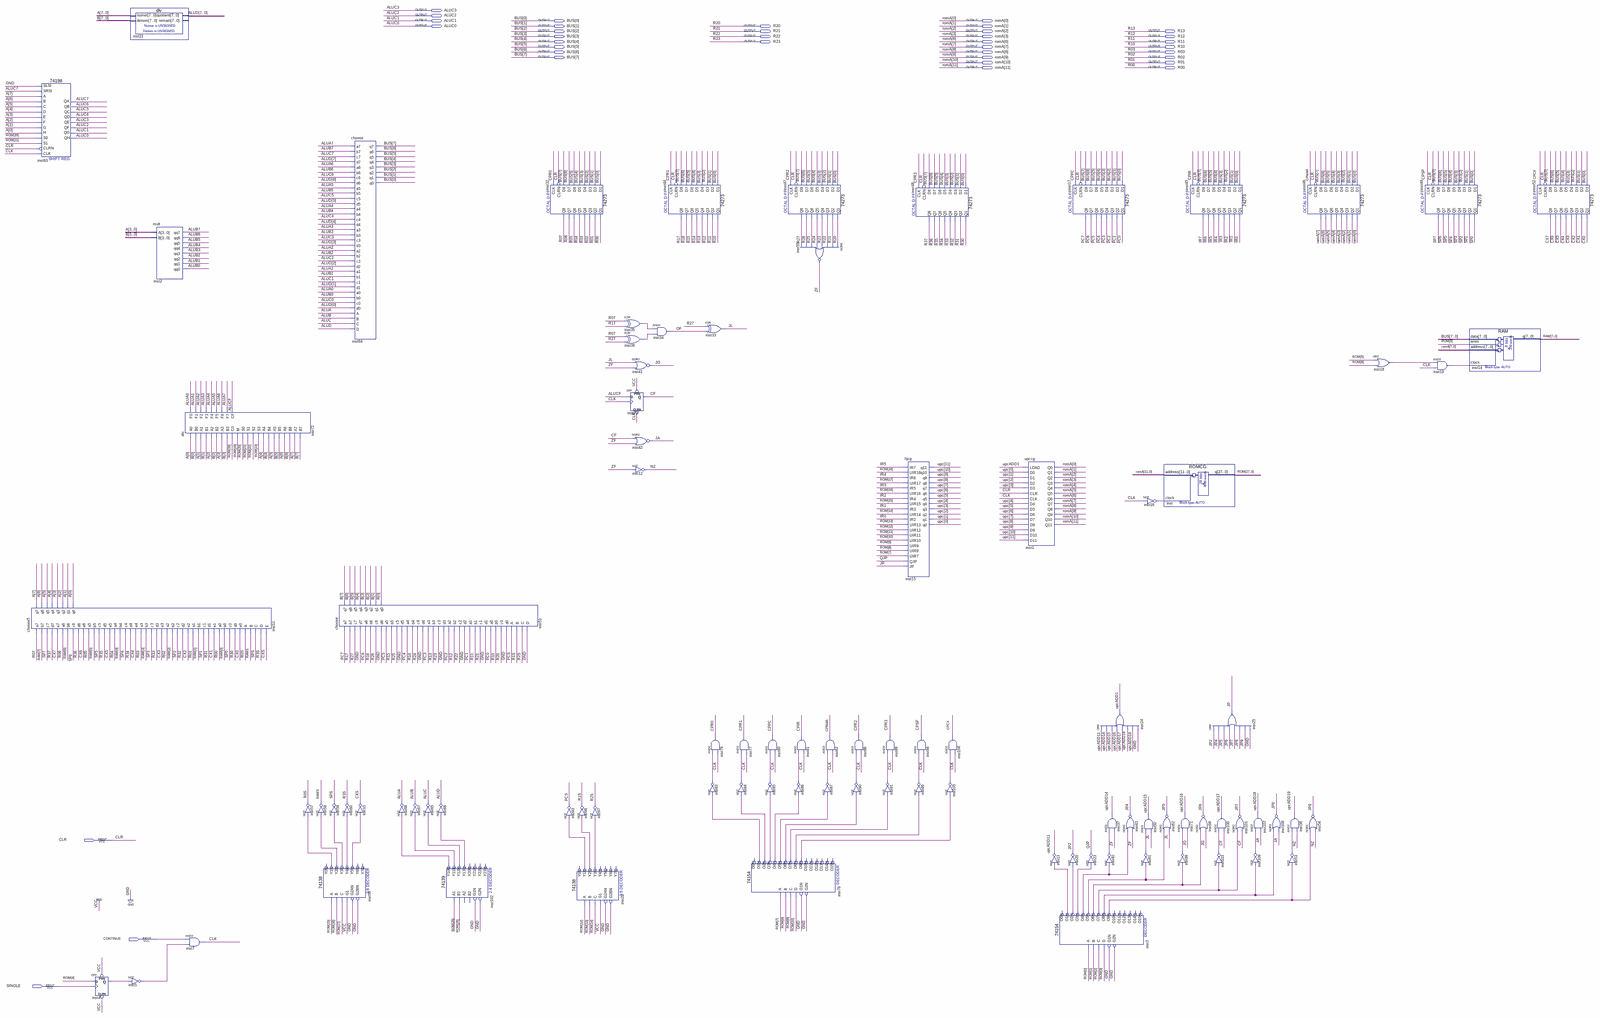
[diagram p0: schematic sheet, whole]
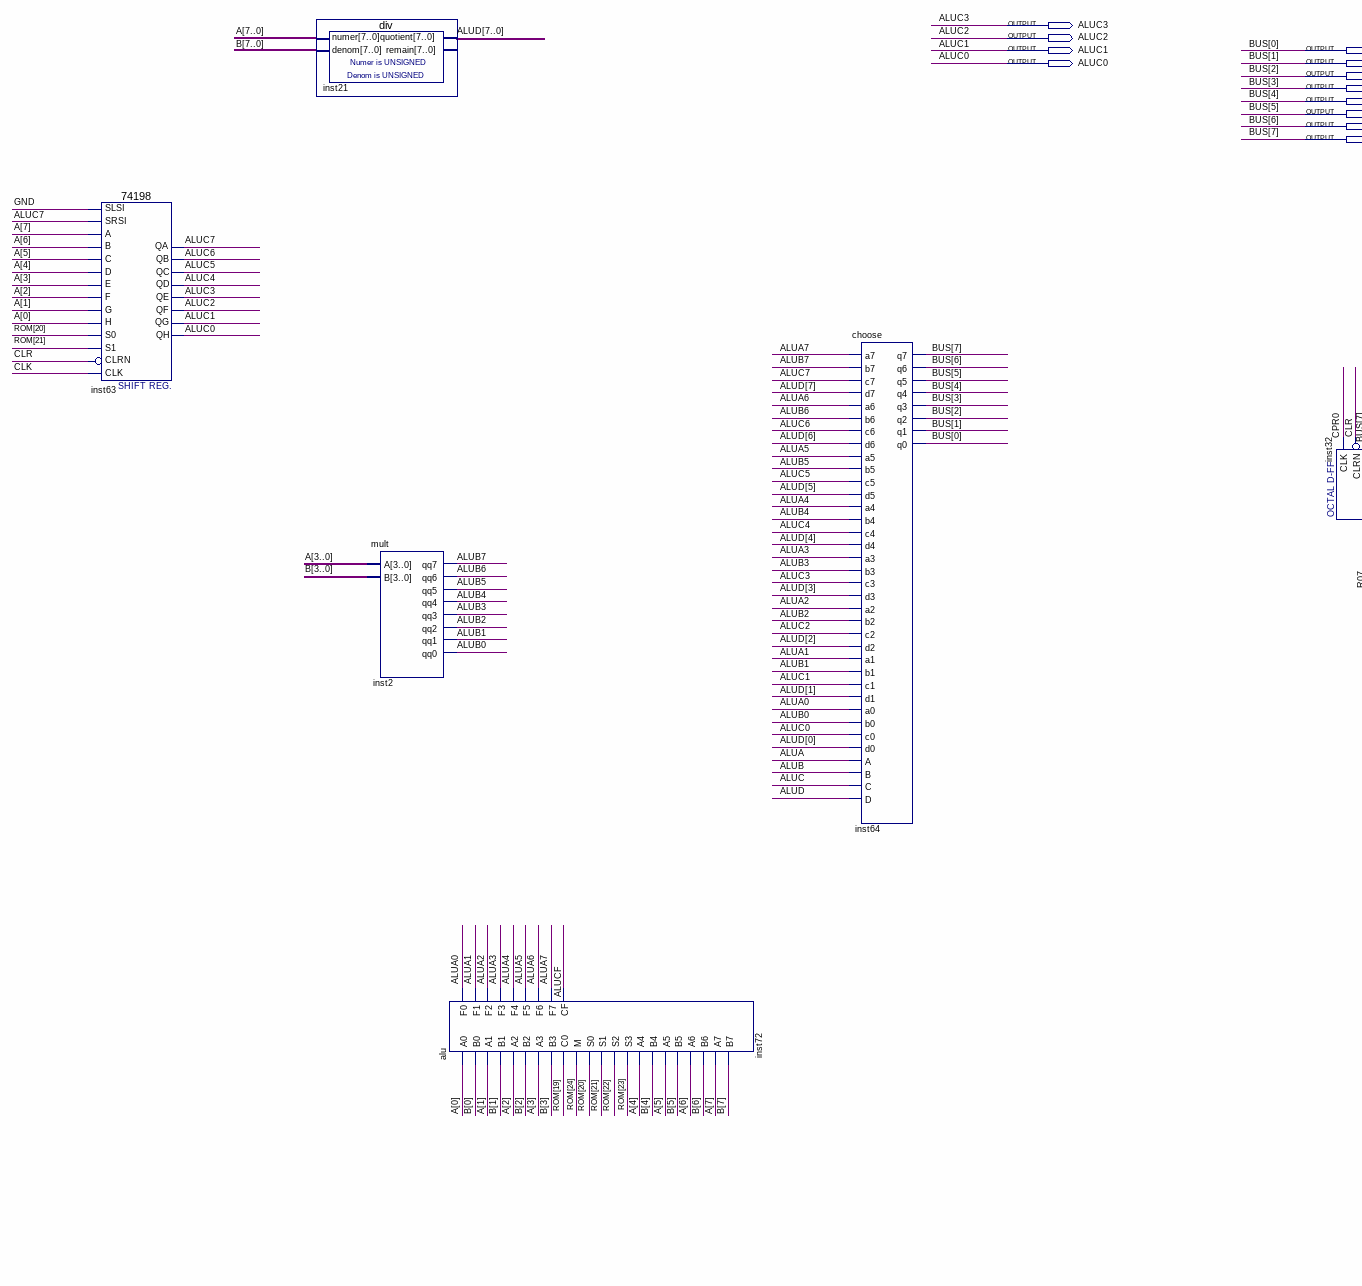
[diagram p1: schematic sheet, upper left part]
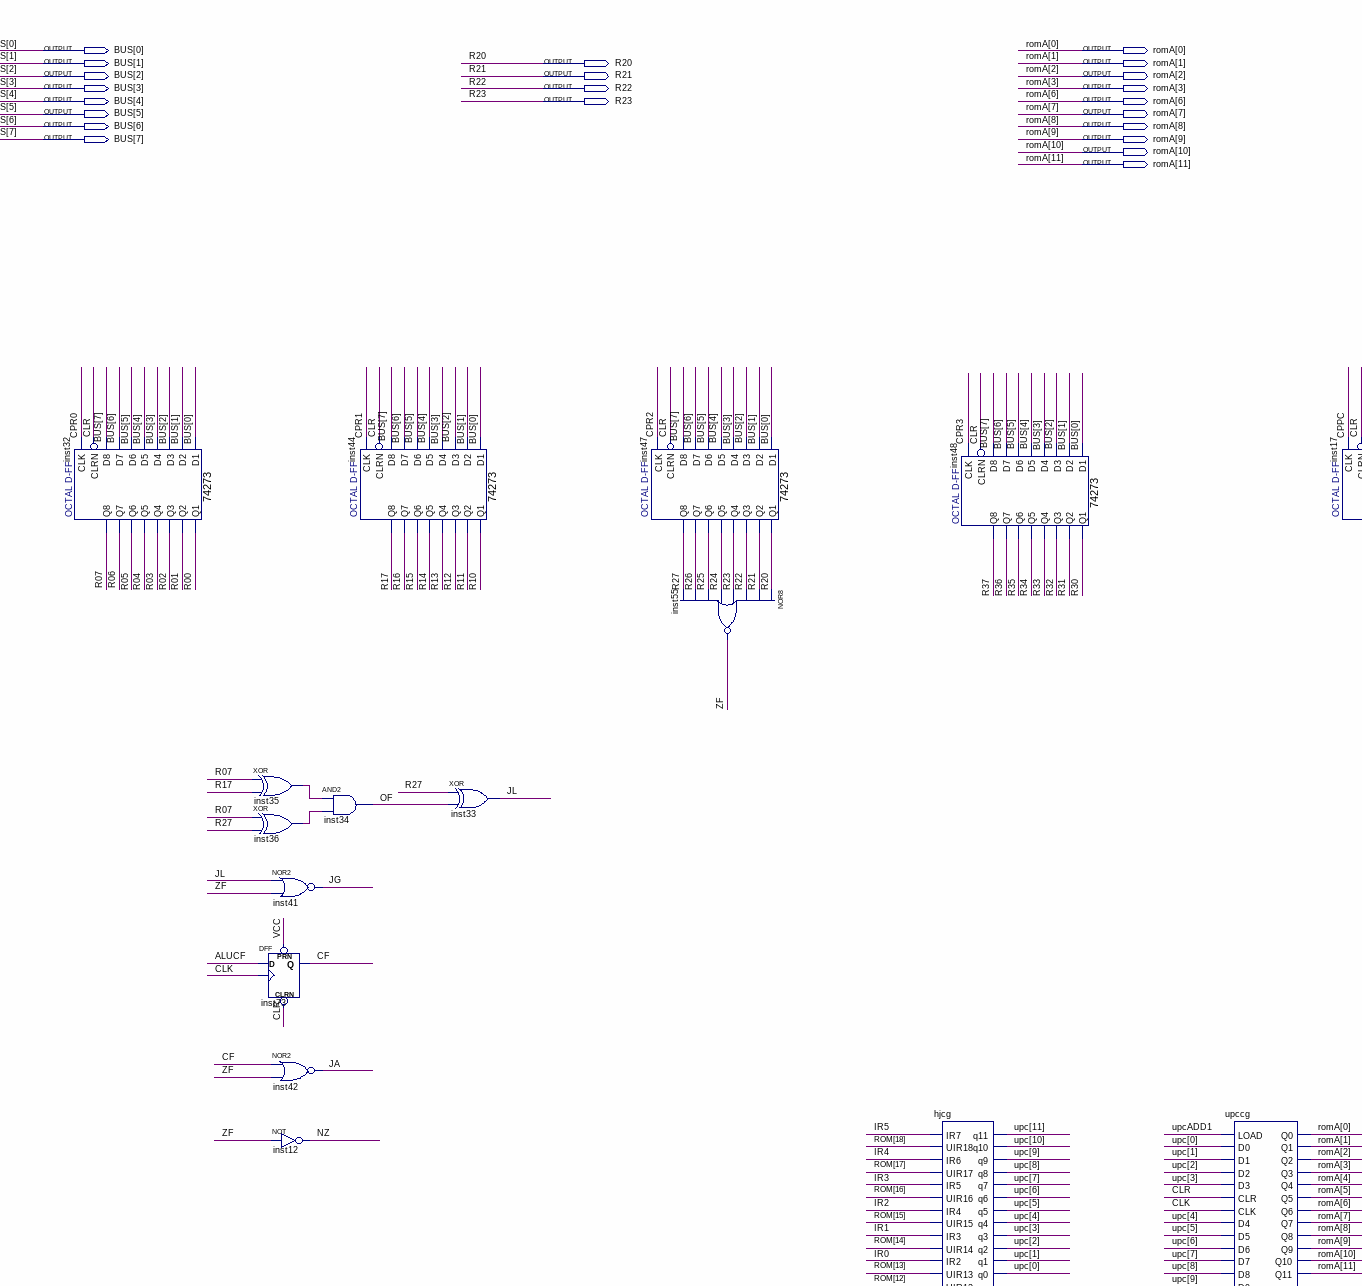
[diagram p2: schematic sheet, upper centre part]
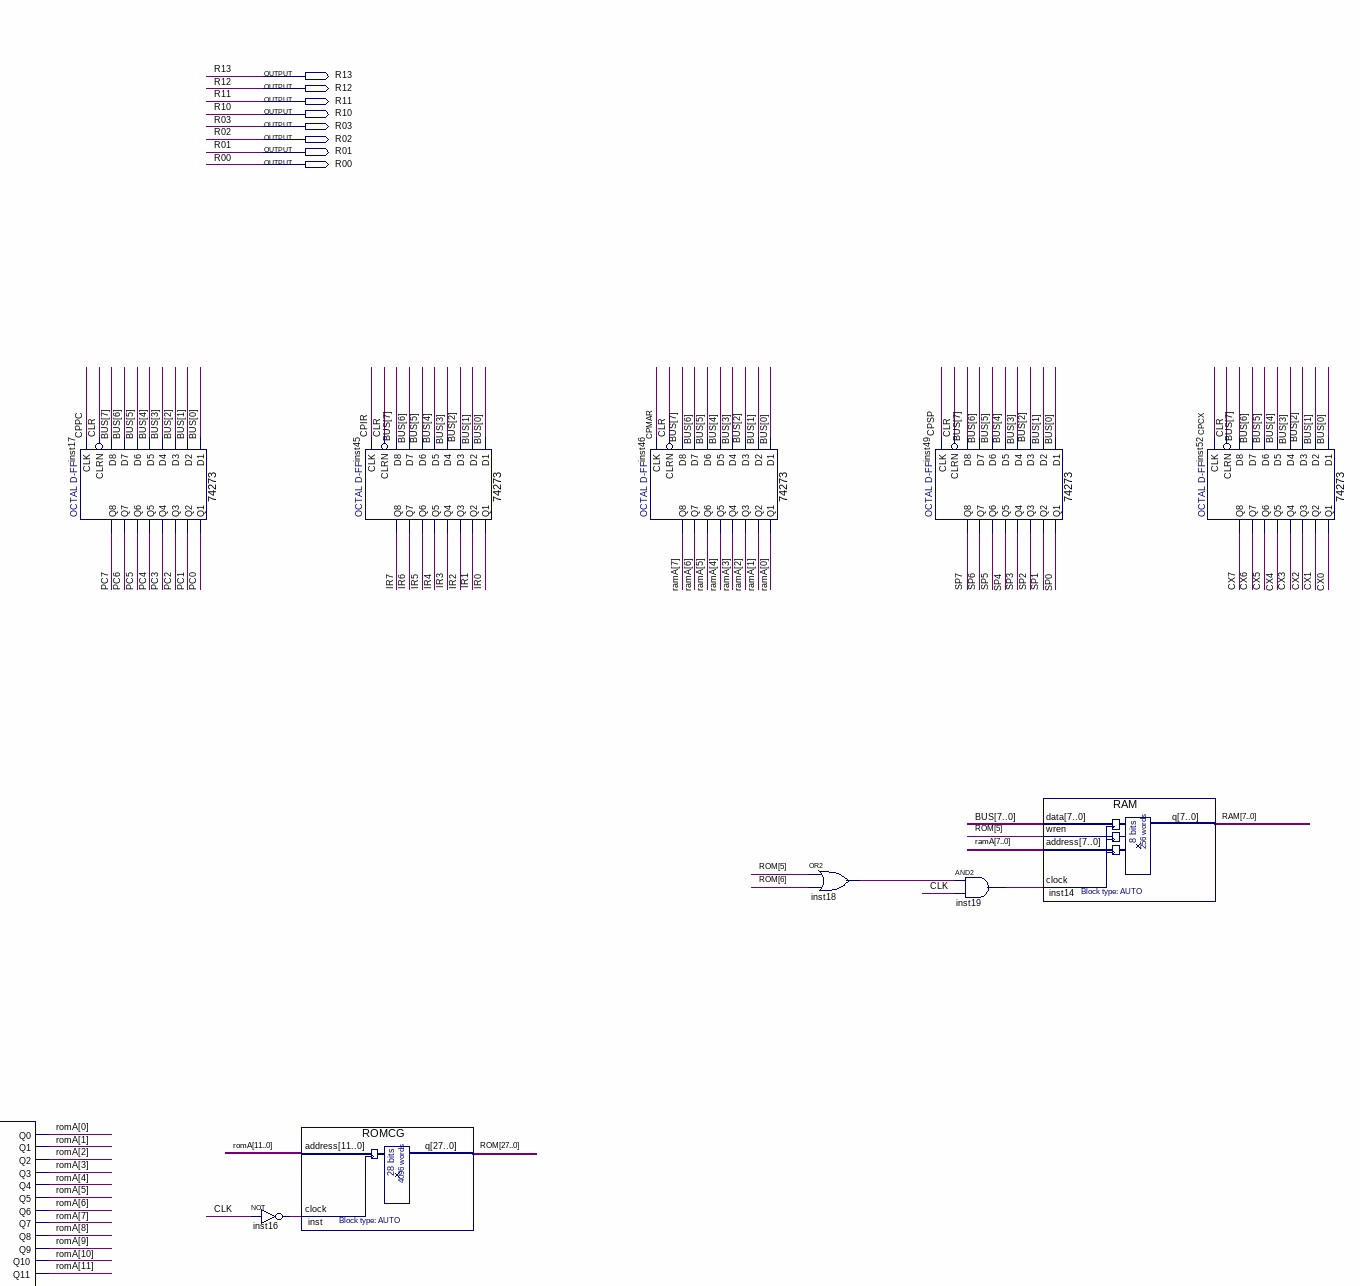
[diagram p3: schematic sheet, upper right part]
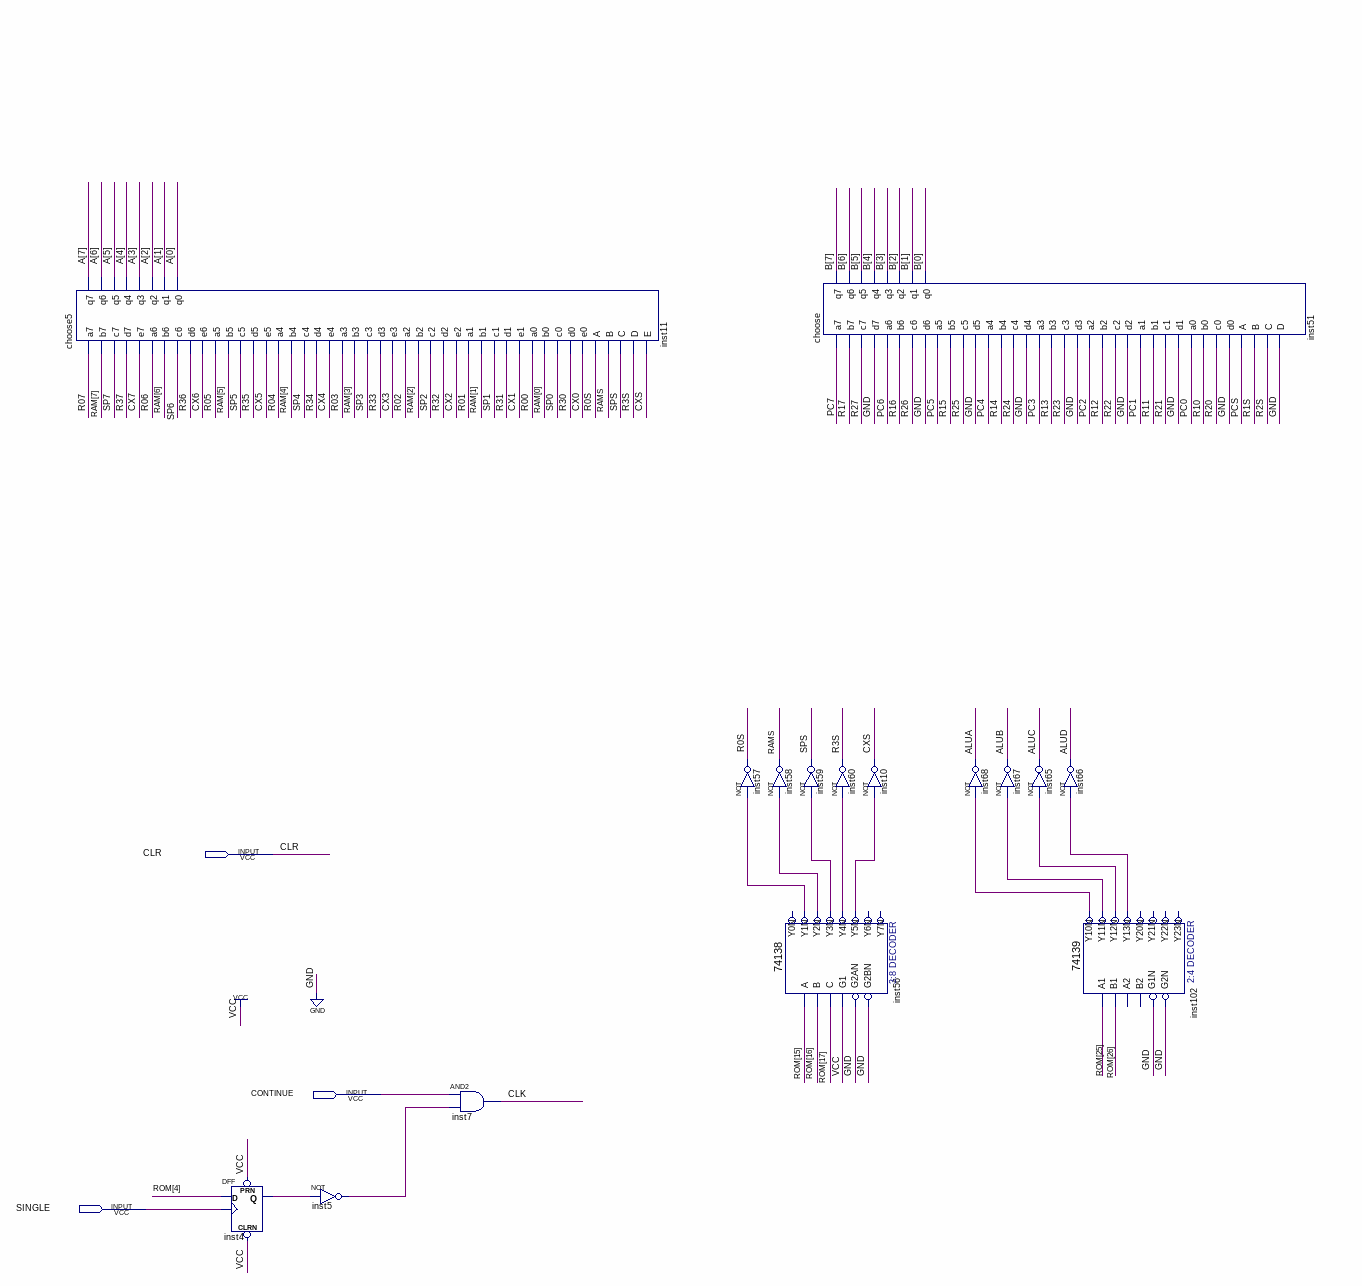
[diagram p4: schematic sheet, lower left part]
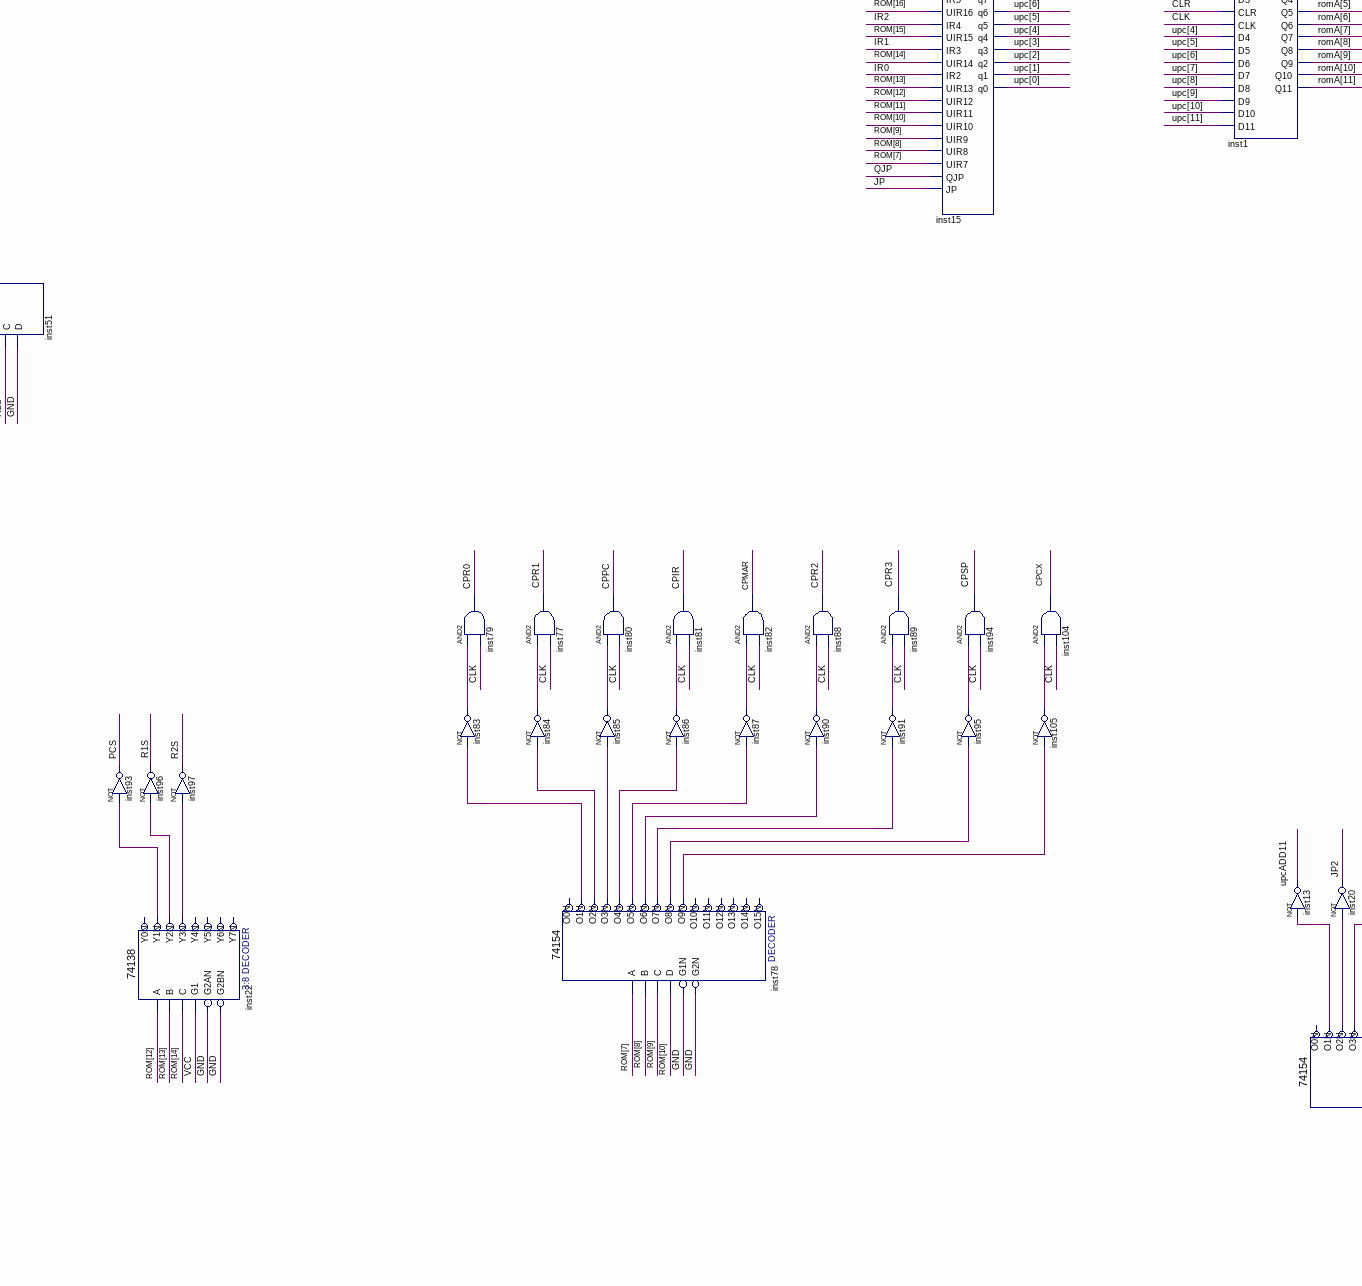
[diagram p5: schematic sheet, lower centre part]
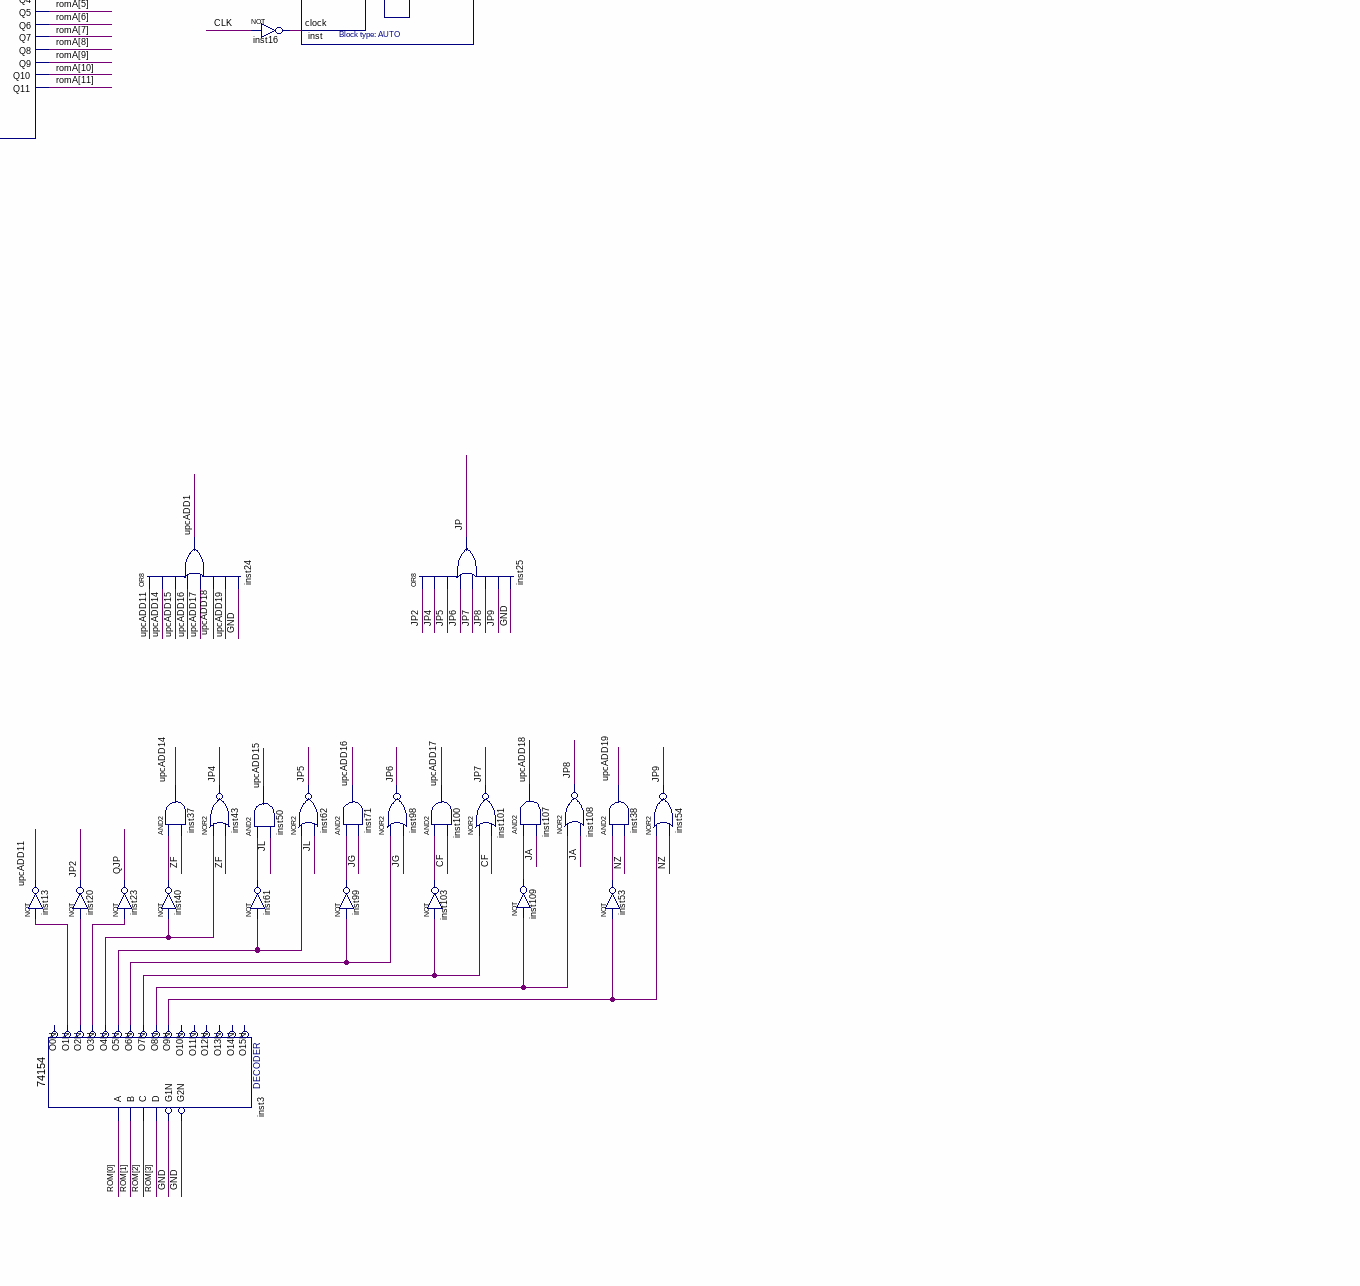
[diagram p6: schematic sheet, lower right part]
// Quartus schematic 3.bdf as structural Verilog: 93 symbols, 37 pins
module \3  (
  input  CLR,
  input  CONTINUE,
  input  SINGLE,
  output ALUC3,
  output ALUC2,
  output ALUC1,
  output [7:0] BUS,
  output [11:0] romA,
  output ALUC0,
  output R20,
  output R21,
  output R13,
  output R22,
  output R12,
  output R23,
  output R11,
  output R10,
  output R03,
  output R02,
  output R01,
  output R00
);

  wire ALUA, ALUA0, ALUA1, ALUA2, ALUA3, ALUA4, ALUA5, ALUA6, ALUA7, ALUB, ALUB0, ALUB1, ALUB2, ALUB3, ALUB4,
       ALUB5, ALUB6, ALUB7, ALUC, ALUC4, ALUC5, ALUC6, ALUC7, ALUCF, ALUD_1bit, CF, CLK, CPCX, CPIR, CPMAR,
       CPPC, CPR0, CPR1, CPR2, CPR3, CPSP, CX0, CX1, CX2, CX3, CX4, CX5, CX6, CX7, CXS, inst3_o1n, inst3_o2n,
       inst3_o3n, inst3_o4n, inst3_o5n, inst3_o6n, inst3_o7n, inst3_o8n, inst3_o9n, inst4_q, inst5_out,
       inst16_out, inst18_out, inst19_out, inst22_y1n, inst22_y2n, inst22_y3n, inst35_out, inst36_out,
       inst40_out, inst53_out, inst56_y1n, inst56_y2n, inst56_y3n, inst56_y4n, inst56_y5n, inst61_out,
       inst78_o1n, inst78_o2n, inst78_o3n, inst78_o4n, inst78_o5n, inst78_o6n, inst78_o7n, inst78_o8n,
       inst78_o9n, inst83_out, inst84_out, inst85_out, inst86_out, inst87_out, inst90_out, inst91_out,
       inst95_out, inst99_out, inst102_y10n, inst102_y11n, inst102_y12n, inst102_y13n, inst103_out,
       inst105_out, inst109_out, IR0, IR1, IR2, IR3, IR4, IR5, IR6, IR7, JA, JG, JL, JP, JP2, JP4, JP5, JP6,
       JP7, JP8, JP9, NZ, OF, PC0, PC1, PC2, PC3, PC4, PC5, PC6, PC7, PCS, QJP, R0S, R1S, R2S, R3S, R04, R05,
       R06, R07, R14, R15, R16, R17, R24, R25, R26, R27, R30, R31, R32, R33, R34, R35, R36, R37, RAMS, SP0,
       SP1, SP2, SP3, SP4, SP5, SP6, SP7, SPS, upcADD1, upcADD11, upcADD14, upcADD15, upcADD16, upcADD17,
       upcADD18, upcADD19, ZF;
  wire [7:0] A, ALUD, B, RAM, ramA;
  wire [11:0] upc;
  wire [27:0] ROM;

  choose5 inst11 (
    .a7(R07), .b7(RAM[7]), .c7(SP7), .d7(R37), .e7(CX7), .a6(R06), .b6(RAM[6]), .c6(SP6), .d6(R36), .e6(CX6),
    .a5(R05), .b5(RAM[5]), .c5(SP5), .d5(R35), .e5(CX5), .a4(R04), .b4(RAM[4]), .c4(SP4), .d4(R34), .e4(CX4),
    .a3(R03), .b3(RAM[3]), .c3(SP3), .d3(R33), .e3(CX3), .a2(R02), .b2(RAM[2]), .c2(SP2), .d2(R32), .e2(CX2),
    .a1(R01), .b1(RAM[1]), .c1(SP1), .d1(R31), .e1(CX1), .a0(R00), .b0(RAM[0]), .c0(SP0), .d0(R30), .e0(CX0),
    .A(R0S), .B(RAMS), .C(SPS), .D(R3S), .E(CXS), .q7(A[7]), .q6(A[6]), .q5(A[5]), .q4(A[4]), .q3(A[3]),
    .q2(A[2]), .q1(A[1]), .q0(A[0]));
  \74198  inst63 (
    .A(A[7]), .SRSI(ALUC7), .SLSI(1'b0), .E(A[3]), .S0(ROM[20]), .B(A[6]), .C(A[5]), .D(A[4]), .H(A[0]),
    .G(A[1]), .CLRN(CLR), .CLK(CLK), .F(A[2]), .S1(ROM[21]), .QD(ALUC4), .QC(ALUC5), .QH(ALUC0), .QA(ALUC7),
    .QB(ALUC6), .QE(ALUC3), .QF(ALUC2), .QG(ALUC1));
  DFF inst4 (.CLRN(1'b1), .CLK(SINGLE), .D(ROM[4]), .PRN(1'b1), .Q(inst4_q));
  div inst21 (.numer(A), .denom(B), .quotient(ALUD));  // open: remain
  not inst5 (inst5_out, inst4_q);
  mult inst2 (
    .A(A[3:0]), .B(B[3:0]), .qq7(ALUB7), .qq6(ALUB6), .qq5(ALUB5), .qq4(ALUB4), .qq3(ALUB3), .qq2(ALUB2),
    .qq1(ALUB1), .qq0(ALUB0));
  alu inst72 (
    .A0(A[0]), .B0(B[0]), .A1(A[1]), .B1(B[1]), .A2(A[2]), .B2(B[2]), .A3(A[3]), .B3(B[3]), .C0(ROM[19]),
    .M(ROM[24]), .S0(ROM[20]), .S1(ROM[21]), .S2(ROM[22]), .S3(ROM[23]), .A4(A[4]), .B4(B[4]), .A5(A[5]),
    .B5(B[5]), .A6(A[6]), .B6(B[6]), .A7(A[7]), .B7(B[7]), .F0(ALUA0), .F1(ALUA1), .F2(ALUA2), .F3(ALUA3),
    .F4(ALUA4), .F5(ALUA5), .F6(ALUA6), .F7(ALUA7), .CF(ALUCF));
  and inst7 (CLK, CONTINUE, inst5_out);
  not inst57 (R0S, inst56_y1n);
  not inst58 (RAMS, inst56_y2n);
  \74138  inst56 (
    .A(ROM[15]), .B(ROM[16]), .G1(1'b1), .C(ROM[17]), .G2AN(1'b0), .G2BN(1'b0), .Y1N(inst56_y1n),
    .Y2N(inst56_y2n), .Y3N(inst56_y3n), .Y4N(inst56_y4n), .Y5N(inst56_y5n));  // open: Y0N, Y6N, Y7N
  choose inst51 (
    .a7(PC7), .b7(R17), .c7(R27), .d7(1'b0), .a6(PC6), .b6(R16), .c6(R26), .d6(1'b0), .a5(PC5), .b5(R15),
    .c5(R25), .d5(1'b0), .a4(PC4), .b4(R14), .c4(R24), .d4(1'b0), .a3(PC3), .b3(R13), .c3(R23), .d3(1'b0),
    .a2(PC2), .b2(R12), .c2(R22), .d2(1'b0), .a1(PC1), .b1(R11), .c1(R21), .d1(1'b0), .a0(PC0), .b0(R10),
    .c0(R20), .d0(1'b0), .A(PCS), .B(R1S), .C(R2S), .D(1'b0), .q7(B[7]), .q6(B[6]), .q5(B[5]), .q4(B[4]),
    .q3(B[3]), .q2(B[2]), .q1(B[1]), .q0(B[0]));
  not inst59 (SPS, inst56_y3n);
  not inst60 (R3S, inst56_y4n);
  choose inst64 (
    .a7(ALUA7), .b7(ALUB7), .c7(ALUC7), .d7(ALUD[7]), .a6(ALUA6), .b6(ALUB6), .c6(ALUC6), .d6(ALUD[6]),
    .a5(ALUA5), .b5(ALUB5), .c5(ALUC5), .d5(ALUD[5]), .a4(ALUA4), .b4(ALUB4), .c4(ALUC4), .d4(ALUD[4]),
    .a3(ALUA3), .b3(ALUB3), .c3(ALUC3), .d3(ALUD[3]), .a2(ALUA2), .b2(ALUB2), .c2(ALUC2), .d2(ALUD[2]),
    .a1(ALUA1), .b1(ALUB1), .c1(ALUC1), .d1(ALUD[1]), .a0(ALUA0), .b0(ALUB0), .c0(ALUC0), .d0(ALUD[0]),
    .A(ALUA), .B(ALUB), .C(ALUC), .D(ALUD_1bit), .q7(BUS[7]), .q6(BUS[6]), .q5(BUS[5]), .q4(BUS[4]),
    .q3(BUS[3]), .q2(BUS[2]), .q1(BUS[1]), .q0(BUS[0]));
  not inst10 (CXS, inst56_y5n);
  not inst67 (ALUB, inst102_y11n);
  not inst68 (ALUA, inst102_y10n);
  not inst65 (ALUC, inst102_y12n);
  not inst66 (ALUD_1bit, inst102_y13n);
  \74139  inst102 (
    .A1(ROM[25]), .B1(ROM[26]), .G1N(1'b0), .G2N(1'b0), .Y10N(inst102_y10n), .Y13N(inst102_y13n),
    .Y12N(inst102_y12n), .Y11N(inst102_y11n));  // open: A2, B2, Y20N, Y21N, Y22N, Y23N
  \74273  inst32 (
    .D2(BUS[1]), .D3(BUS[2]), .D1(BUS[0]), .D4(BUS[3]), .D7(BUS[6]), .D6(BUS[5]), .D5(BUS[4]), .D8(BUS[7]),
    .CLK(CPR0), .CLRN(CLR), .Q4(R03), .Q1(R00), .Q2(R01), .Q3(R02), .Q6(R05), .Q5(R04), .Q7(R06), .Q8(R07));
  not inst93 (PCS, inst22_y1n);
  not inst96 (R1S, inst22_y2n);
  \74138  inst22 (
    .A(ROM[12]), .B(ROM[13]), .G1(1'b1), .C(ROM[14]), .G2AN(1'b0), .G2BN(1'b0), .Y1N(inst22_y1n),
    .Y2N(inst22_y2n), .Y3N(inst22_y3n));  // open: Y0N, Y4N, Y5N, Y6N, Y7N
  not inst97 (R2S, inst22_y3n);
  xor inst35 (inst35_out, R07, R17);
  xor inst36 (inst36_out, R07, R27);
  nor inst41 (JG, JL, ZF);
  DFF inst73 (.CLRN(CLR), .CLK(CLK), .D(ALUCF), .PRN(1'b1), .Q(CF));
  nor inst42 (JA, CF, ZF);
  not inst12 (NZ, ZF);
  and inst34 (OF, inst35_out, inst36_out);
  \74273  inst44 (
    .D2(BUS[1]), .D3(BUS[2]), .D1(BUS[0]), .D4(BUS[3]), .D7(BUS[6]), .D6(BUS[5]), .D5(BUS[4]), .D8(BUS[7]),
    .CLK(CPR1), .CLRN(CLR), .Q4(R13), .Q1(R10), .Q2(R11), .Q3(R12), .Q6(R15), .Q5(R14), .Q7(R16), .Q8(R17));
  xor inst33 (JL, R27, OF);
  and inst79 (CPR0, inst83_out, CLK);
  not inst83 (inst83_out, inst78_o1n);
  and inst77 (CPR1, inst84_out, CLK);
  not inst84 (inst84_out, inst78_o2n);
  and inst80 (CPPC, inst85_out, CLK);
  not inst85 (inst85_out, inst78_o3n);
  \74154  inst78 (
    .C(ROM[9]), .D(ROM[10]), .B(ROM[8]), .A(ROM[7]), .G1N(1'b0), .G2N(1'b0), .O1N(inst78_o1n),
    .O4N(inst78_o4n), .O3N(inst78_o3n), .O2N(inst78_o2n), .O7N(inst78_o7n), .O6N(inst78_o6n),
    .O5N(inst78_o5n), .O9N(inst78_o9n), .O8N(inst78_o8n));  // open: O0N, O12N, O15N, O10N, O11N, O13N, O14N
  \74273  inst47 (
    .D2(BUS[1]), .D3(BUS[2]), .D1(BUS[0]), .D4(BUS[3]), .D7(BUS[6]), .D6(BUS[5]), .D5(BUS[4]), .D8(BUS[7]),
    .CLK(CPR2), .CLRN(CLR), .Q4(R23), .Q1(R20), .Q2(R21), .Q3(R22), .Q6(R25), .Q5(R24), .Q7(R26), .Q8(R27));
  nor inst55 (ZF, R20, R21, R22, R23, R24, R25, R26, R27);
  and inst81 (CPIR, inst86_out, CLK);
  not inst86 (inst86_out, inst78_o4n);
  and inst82 (CPMAR, inst87_out, CLK);
  not inst87 (inst87_out, inst78_o5n);
  and inst88 (CPR2, inst90_out, CLK);
  not inst90 (inst90_out, inst78_o6n);
  and inst89 (CPR3, inst91_out, CLK);
  not inst91 (inst91_out, inst78_o7n);
  \74273  inst48 (
    .D2(BUS[1]), .D3(BUS[2]), .D1(BUS[0]), .D4(BUS[3]), .D7(BUS[6]), .D6(BUS[5]), .D5(BUS[4]), .D8(BUS[7]),
    .CLK(CPR3), .CLRN(CLR), .Q4(R33), .Q1(R30), .Q2(R31), .Q3(R32), .Q6(R35), .Q5(R34), .Q7(R36), .Q8(R37));
  hjcg inst15 (
    .IR7(IR5), .UIR18(ROM[18]), .IR6(IR4), .UIR17(ROM[17]), .IR5(IR3), .UIR16(ROM[16]), .IR4(IR2),
    .UIR15(ROM[15]), .IR3(IR1), .UIR14(ROM[14]), .IR2(IR0), .UIR13(ROM[13]), .UIR12(ROM[12]),
    .UIR11(ROM[11]), .UIR10(ROM[10]), .UIR9(ROM[9]), .UIR8(ROM[8]), .UIR7(ROM[7]), .QJP(QJP), .JP(JP),
    .q11(upc[11]), .q10(upc[10]), .q9(upc[9]), .q8(upc[8]), .q7(upc[7]), .q6(upc[6]), .q5(upc[5]),
    .q4(upc[4]), .q3(upc[3]), .q2(upc[2]), .q1(upc[1]), .q0(upc[0]));
  and inst94 (CPSP, inst95_out, CLK);
  not inst95 (inst95_out, inst78_o8n);
  and inst104 (CPCX, inst105_out, CLK);
  not inst105 (inst105_out, inst78_o9n);
  upccg inst1 (
    .LOAD(upcADD1), .D0(upc[0]), .D1(upc[1]), .D2(upc[2]), .D3(upc[3]), .CLR(CLR), .CLK(CLK), .D4(upc[4]),
    .D5(upc[5]), .D6(upc[6]), .D7(upc[7]), .D8(upc[8]), .D9(upc[9]), .D10(upc[10]), .D11(upc[11]),
    .Q0(romA[0]), .Q1(romA[1]), .Q2(romA[2]), .Q3(romA[3]), .Q4(romA[4]), .Q5(romA[5]), .Q6(romA[6]),
    .Q7(romA[7]), .Q8(romA[8]), .Q9(romA[9]), .Q10(romA[10]), .Q11(romA[11]));
  not inst13 (upcADD11, inst3_o1n);
  \74154  inst3 (
    .C(ROM[2]), .D(ROM[3]), .B(ROM[1]), .A(ROM[0]), .G1N(1'b0), .G2N(1'b0), .O1N(inst3_o1n), .O4N(inst3_o4n),
    .O3N(inst3_o3n), .O2N(inst3_o2n), .O7N(inst3_o7n), .O6N(inst3_o6n), .O5N(inst3_o5n), .O9N(inst3_o9n),
    .O8N(inst3_o8n));  // open: O0N, O12N, O15N, O10N, O11N, O13N, O14N
  \74273  inst17 (
    .D2(BUS[1]), .D3(BUS[2]), .D1(BUS[0]), .D4(BUS[3]), .D7(BUS[6]), .D6(BUS[5]), .D5(BUS[4]), .D8(BUS[7]),
    .CLK(CPPC), .CLRN(CLR), .Q4(PC3), .Q1(PC0), .Q2(PC1), .Q3(PC2), .Q6(PC5), .Q5(PC4), .Q7(PC6), .Q8(PC7));
  not inst20 (JP2, inst3_o2n);
  or inst24 (upcADD1, upcADD11, upcADD14, upcADD15, upcADD16, upcADD17, upcADD18, upcADD19, 1'b0);
  not inst23 (QJP, inst3_o3n);
  and inst37 (upcADD14, inst40_out, ZF);
  not inst40 (inst40_out, inst3_o4n);
  nor inst43 (JP4, inst3_o4n, ZF);
  and inst50 (upcADD15, inst61_out, JL);
  not inst61 (inst61_out, inst3_o5n);
  not inst16 (inst16_out, CLK);
  nor inst62 (JP5, inst3_o5n, JL);
  ROMCG inst (.address(romA), .clock(inst16_out), .q(ROM));
  and inst71 (upcADD16, inst99_out, JG);
  not inst99 (inst99_out, inst3_o6n);
  \74273  inst45 (
    .D2(BUS[1]), .D3(BUS[2]), .D1(BUS[0]), .D4(BUS[3]), .D7(BUS[6]), .D6(BUS[5]), .D5(BUS[4]), .D8(BUS[7]),
    .CLK(CPIR), .CLRN(CLR), .Q4(IR3), .Q1(IR0), .Q2(IR1), .Q3(IR2), .Q6(IR5), .Q5(IR4), .Q7(IR6), .Q8(IR7));
  nor inst98 (JP6, inst3_o6n, JG);
  or inst25 (JP, JP2, JP4, JP5, JP6, JP7, JP8, JP9, 1'b0);
  and inst100 (upcADD17, inst103_out, CF);
  not inst103 (inst103_out, inst3_o7n);
  nor inst101 (JP7, inst3_o7n, CF);
  and inst107 (upcADD18, inst109_out, JA);
  not inst109 (inst109_out, inst3_o8n);
  nor inst108 (JP8, inst3_o8n, JA);
  and inst38 (upcADD19, inst53_out, NZ);
  not inst53 (inst53_out, inst3_o9n);
  \74273  inst46 (
    .D2(BUS[1]), .D3(BUS[2]), .D1(BUS[0]), .D4(BUS[3]), .D7(BUS[6]), .D6(BUS[5]), .D5(BUS[4]), .D8(BUS[7]),
    .CLK(CPMAR), .CLRN(CLR), .Q4(ramA[3]), .Q1(ramA[0]), .Q2(ramA[1]), .Q3(ramA[2]), .Q6(ramA[5]),
    .Q5(ramA[4]), .Q7(ramA[6]), .Q8(ramA[7]));
  nor inst54 (JP9, inst3_o9n, NZ);
  or inst18 (inst18_out, ROM[5], ROM[6]);
  \74273  inst49 (
    .D2(BUS[1]), .D3(BUS[2]), .D1(BUS[0]), .D4(BUS[3]), .D7(BUS[6]), .D6(BUS[5]), .D5(BUS[4]), .D8(BUS[7]),
    .CLK(CPSP), .CLRN(CLR), .Q4(SP3), .Q1(SP0), .Q2(SP1), .Q3(SP2), .Q6(SP5), .Q5(SP4), .Q7(SP6), .Q8(SP7));
  and inst19 (inst19_out, inst18_out, CLK);
  RAM inst14 (.data(BUS), .wren(ROM[5]), .address(ramA), .clock(inst19_out), .q(RAM));
  \74273  inst52 (
    .D2(BUS[1]), .D3(BUS[2]), .D1(BUS[0]), .D4(BUS[3]), .D7(BUS[6]), .D6(BUS[5]), .D5(BUS[4]), .D8(BUS[7]),
    .CLK(CPCX), .CLRN(CLR), .Q4(CX3), .Q1(CX0), .Q2(CX1), .Q3(CX2), .Q6(CX5), .Q5(CX4), .Q7(CX6), .Q8(CX7));
endmodule
